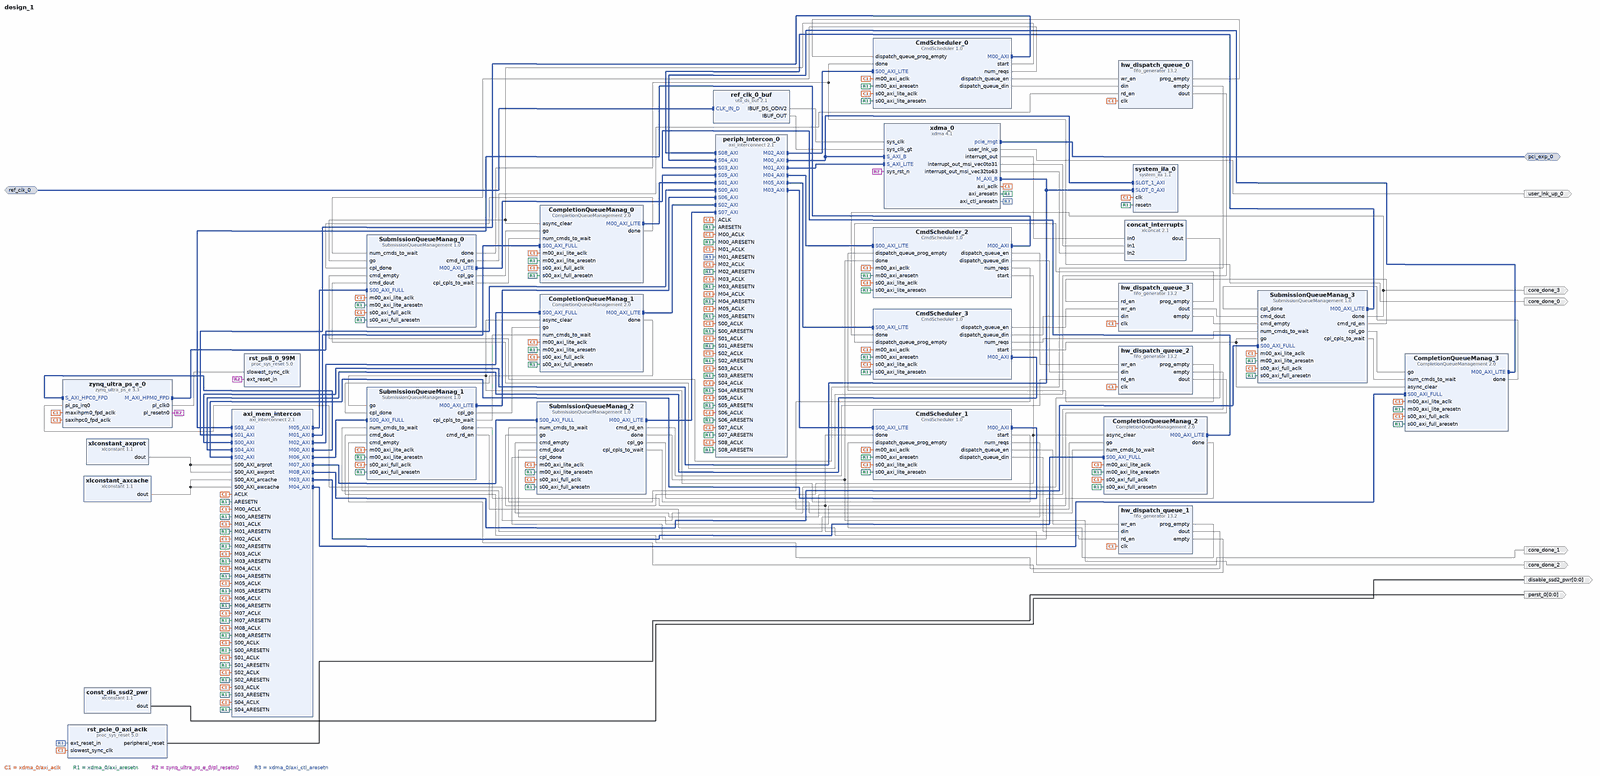
[diagram p0: block diagram of the top level, whole]
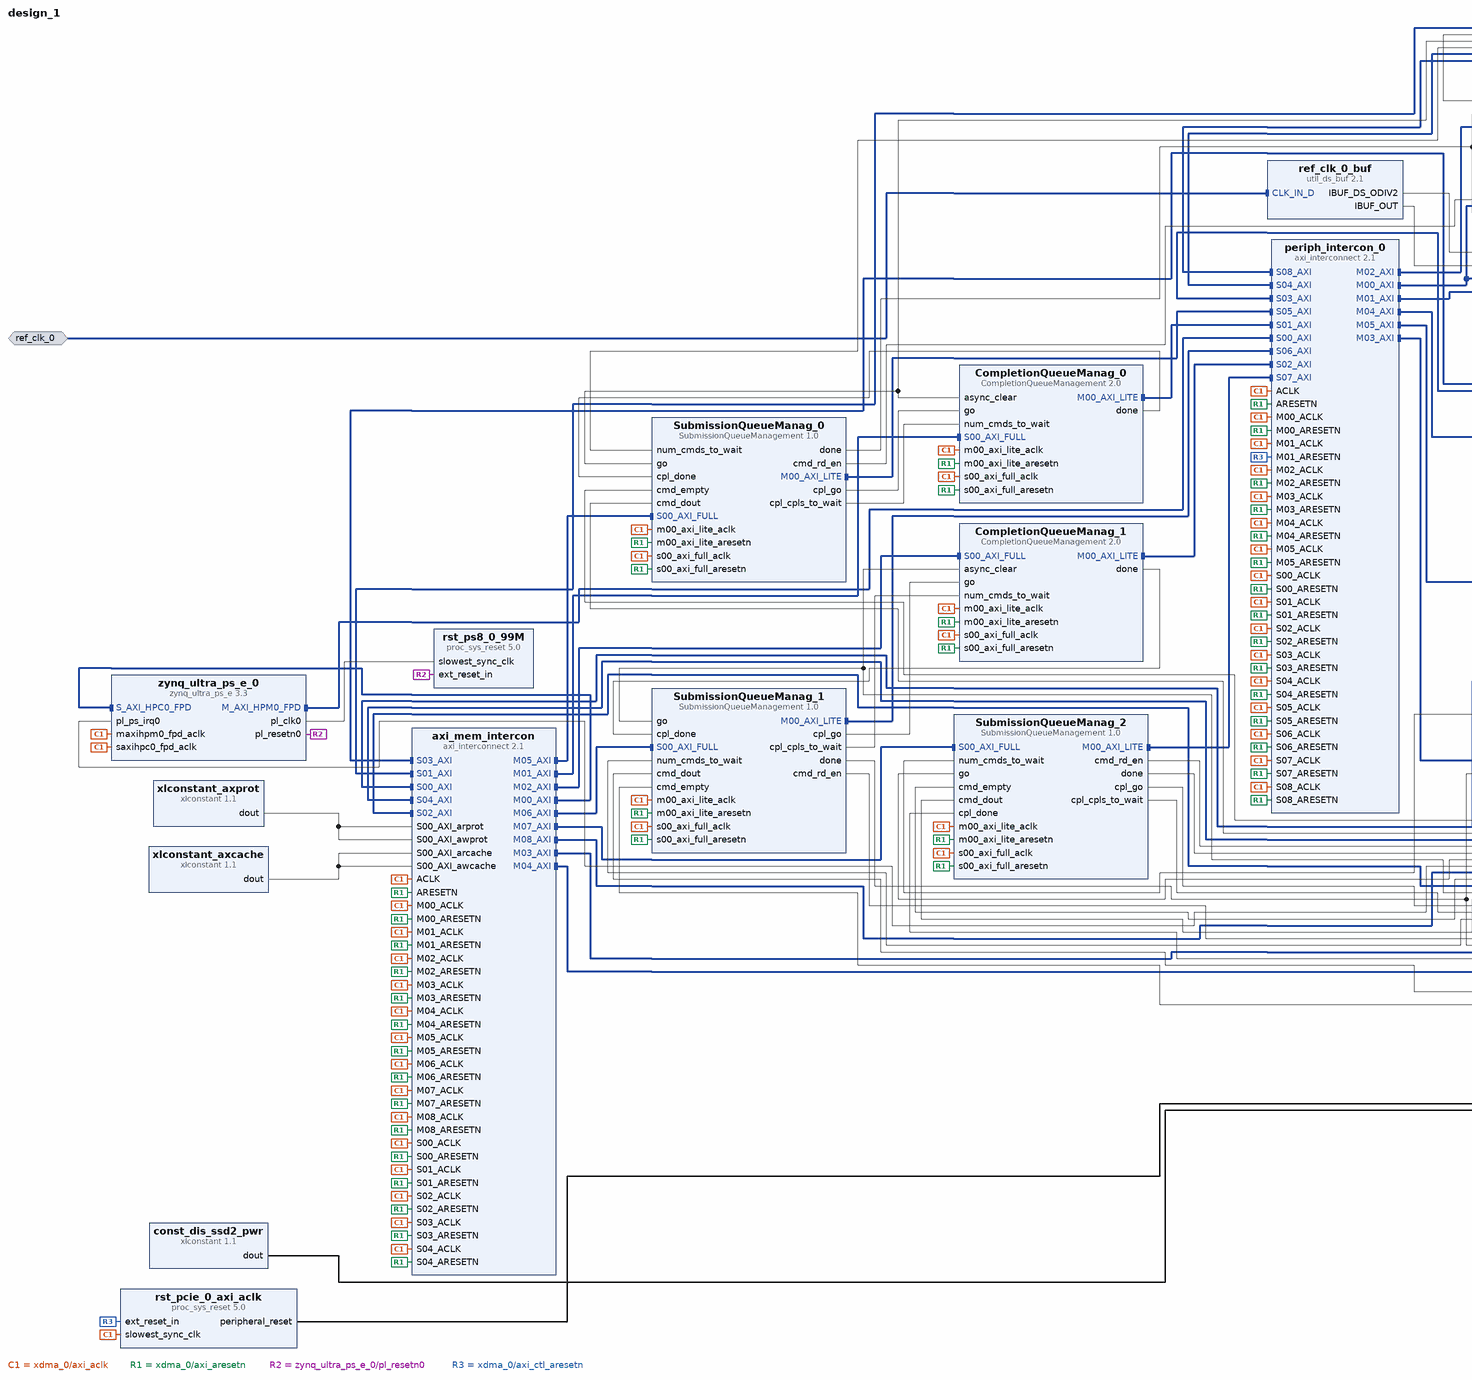
[diagram p1: block diagram of the top level, left part]
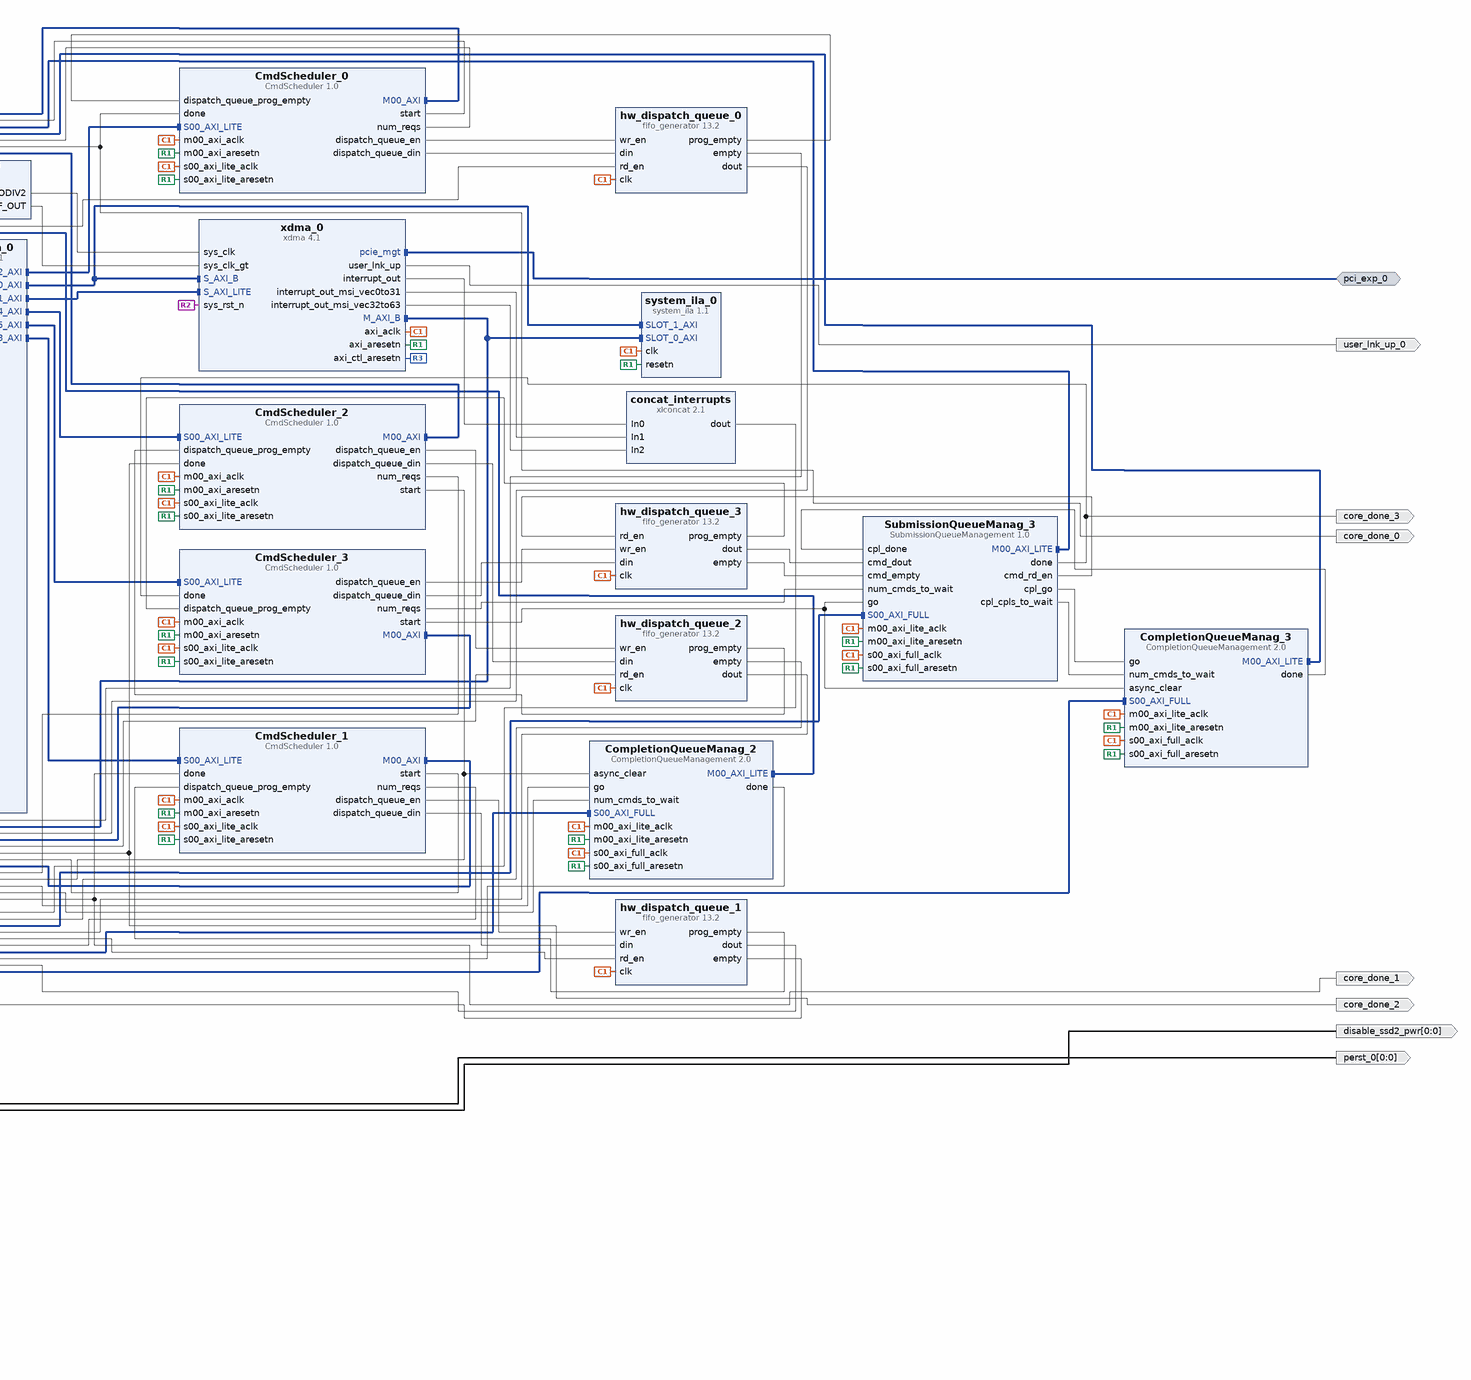
[diagram p2: block diagram of the top level, right part]
# Vivado block design design_1, xczu7ev-ffvc1156-2-e, Vivado 2019.2
create_bd_design design_1

create_bd_intf_port -mode Master -vlnv xilinx.com:interface:pcie_7x_mgt_rtl:1.0 pci_exp_0
create_bd_intf_port -mode Slave -vlnv xilinx.com:interface:diff_clock_rtl:1.0 ref_clk_0
create_bd_port -dir O -from 0 -to 0 -type rst perst_0
create_bd_port -dir O -from 0 -to 0 disable_ssd2_pwr
create_bd_port -dir O user_lnk_up_0
create_bd_port -dir O core_done_0
create_bd_port -dir O core_done_1
create_bd_port -dir O core_done_2
create_bd_port -dir O core_done_3

create_bd_cell -type ip -vlnv xilinx.com:ip:xlconcat:2.1 concat_interrupts
set_property -dict {CONFIG.NUM_PORTS 3} [get_bd_cells concat_interrupts]
create_bd_cell -type ip -vlnv xilinx.com:ip:fifo_generator:13.2 hw_dispatch_queue_0
set_property -dict [list \
  CONFIG.Empty_Threshold_Assert_Value 32 \
  CONFIG.Fifo_Implementation Common_Clock_Distributed_RAM \
  CONFIG.Input_Data_Width 192 \
  CONFIG.Input_Depth 64 \
  CONFIG.Performance_Options First_Word_Fall_Through \
  CONFIG.Programmable_Empty_Type Single_Programmable_Empty_Threshold_Constant \
  CONFIG.Reset_Pin false \
] [get_bd_cells hw_dispatch_queue_0]
create_bd_cell -type ip -vlnv xilinx.com:ip:fifo_generator:13.2 hw_dispatch_queue_1
set_property -dict [list \
  CONFIG.Empty_Threshold_Assert_Value 32 \
  CONFIG.Fifo_Implementation Common_Clock_Distributed_RAM \
  CONFIG.Input_Data_Width 192 \
  CONFIG.Input_Depth 64 \
  CONFIG.Performance_Options First_Word_Fall_Through \
  CONFIG.Programmable_Empty_Type Single_Programmable_Empty_Threshold_Constant \
  CONFIG.Reset_Pin false \
] [get_bd_cells hw_dispatch_queue_1]
create_bd_cell -type ip -vlnv xilinx.com:ip:fifo_generator:13.2 hw_dispatch_queue_2
set_property -dict [list \
  CONFIG.Empty_Threshold_Assert_Value 32 \
  CONFIG.Fifo_Implementation Common_Clock_Distributed_RAM \
  CONFIG.Input_Data_Width 192 \
  CONFIG.Input_Depth 64 \
  CONFIG.Performance_Options First_Word_Fall_Through \
  CONFIG.Programmable_Empty_Type Single_Programmable_Empty_Threshold_Constant \
  CONFIG.Reset_Pin false \
] [get_bd_cells hw_dispatch_queue_2]
create_bd_cell -type ip -vlnv xilinx.com:ip:fifo_generator:13.2 hw_dispatch_queue_3
set_property -dict [list \
  CONFIG.Empty_Threshold_Assert_Value 32 \
  CONFIG.Fifo_Implementation Common_Clock_Distributed_RAM \
  CONFIG.Input_Data_Width 192 \
  CONFIG.Input_Depth 64 \
  CONFIG.Performance_Options First_Word_Fall_Through \
  CONFIG.Programmable_Empty_Type Single_Programmable_Empty_Threshold_Constant \
  CONFIG.Reset_Pin false \
] [get_bd_cells hw_dispatch_queue_3]
create_bd_cell -type ip -vlnv user.org:user:CompletionQueueManagement:2.0 CompletionQueueManag_0
set_property -dict [list \
  CONFIG.CPL_ENTRY_ADDR_WIDTH 5 \
  CONFIG.C_M00_AXI_LITE_TARGET_SLAVE_BASE_ADDR 0x00000000A000100C \
] [get_bd_cells CompletionQueueManag_0]
create_bd_cell -type ip -vlnv user.org:user:CompletionQueueManagement:2.0 CompletionQueueManag_1
set_property -dict [list \
  CONFIG.CPL_ENTRY_ADDR_WIDTH 5 \
  CONFIG.C_M00_AXI_LITE_TARGET_SLAVE_BASE_ADDR 0x00000000A0001014 \
] [get_bd_cells CompletionQueueManag_1]
create_bd_cell -type ip -vlnv user.org:user:CompletionQueueManagement:2.0 CompletionQueueManag_2
set_property -dict [list \
  CONFIG.CPL_ENTRY_ADDR_WIDTH 5 \
  CONFIG.C_M00_AXI_LITE_TARGET_SLAVE_BASE_ADDR 0x00000000A000101C \
] [get_bd_cells CompletionQueueManag_2]
create_bd_cell -type ip -vlnv user.org:user:CompletionQueueManagement:2.0 CompletionQueueManag_3
set_property -dict [list \
  CONFIG.CPL_ENTRY_ADDR_WIDTH 5 \
  CONFIG.C_M00_AXI_LITE_TARGET_SLAVE_BASE_ADDR 0x00000000A0001024 \
] [get_bd_cells CompletionQueueManag_3]
create_bd_cell -type ip -vlnv user.org:user:SubmissionQueueManagement:1.0 SubmissionQueueManag_0
set_property -dict [list \
  CONFIG.C_M00_AXI_LITE_TARGET_SLAVE_BASE_ADDR 0x00000000A0001008 \
  CONFIG.QUEUE_ADDR_WIDTH 5 \
] [get_bd_cells SubmissionQueueManag_0]
create_bd_cell -type ip -vlnv user.org:user:SubmissionQueueManagement:1.0 SubmissionQueueManag_1
set_property -dict [list \
  CONFIG.C_M00_AXI_LITE_TARGET_SLAVE_BASE_ADDR 0x00000000A0001010 \
  CONFIG.QUEUE_ADDR_WIDTH 5 \
] [get_bd_cells SubmissionQueueManag_1]
create_bd_cell -type ip -vlnv user.org:user:SubmissionQueueManagement:1.0 SubmissionQueueManag_2
set_property -dict [list \
  CONFIG.C_M00_AXI_LITE_TARGET_SLAVE_BASE_ADDR 0x00000000A0001018 \
  CONFIG.QUEUE_ADDR_WIDTH 5 \
] [get_bd_cells SubmissionQueueManag_2]
create_bd_cell -type ip -vlnv user.org:user:SubmissionQueueManagement:1.0 SubmissionQueueManag_3
set_property -dict [list \
  CONFIG.C_M00_AXI_LITE_TARGET_SLAVE_BASE_ADDR 0x00000000A0001020 \
  CONFIG.QUEUE_ADDR_WIDTH 5 \
] [get_bd_cells SubmissionQueueManag_3]
create_bd_cell -type ip -vlnv xilinx.com:ip:proc_sys_reset:5.0 rst_pcie_0_axi_aclk
create_bd_cell -type ip -vlnv xilinx.com:ip:proc_sys_reset:5.0 rst_ps8_0_99M
create_bd_cell -type ip -vlnv user.org:user:CmdScheduler:1.0 CmdScheduler_0
set_property -dict {CONFIG.DISPATCH_QUEUE_DEPTH 64} [get_bd_cells CmdScheduler_0]
create_bd_cell -type ip -vlnv user.org:user:CmdScheduler:1.0 CmdScheduler_1
set_property -dict {CONFIG.DISPATCH_QUEUE_DEPTH 64} [get_bd_cells CmdScheduler_1]
create_bd_cell -type ip -vlnv user.org:user:CmdScheduler:1.0 CmdScheduler_2
set_property -dict {CONFIG.DISPATCH_QUEUE_DEPTH 64} [get_bd_cells CmdScheduler_2]
create_bd_cell -type ip -vlnv user.org:user:CmdScheduler:1.0 CmdScheduler_3
set_property -dict {CONFIG.DISPATCH_QUEUE_DEPTH 64} [get_bd_cells CmdScheduler_3]
create_bd_cell -type ip -vlnv xilinx.com:ip:axi_interconnect:2.1 axi_mem_intercon
set_property -dict [list \
  CONFIG.NUM_MI 9 \
  CONFIG.NUM_SI 5 \
  CONFIG.S00_HAS_DATA_FIFO 2 \
  CONFIG.S01_HAS_DATA_FIFO 2 \
  CONFIG.S02_HAS_DATA_FIFO 2 \
  CONFIG.S03_HAS_DATA_FIFO 2 \
  CONFIG.S04_HAS_DATA_FIFO 2 \
  CONFIG.S05_HAS_DATA_FIFO 2 \
  CONFIG.S06_HAS_DATA_FIFO 2 \
  CONFIG.S07_HAS_DATA_FIFO 2 \
  CONFIG.S08_HAS_DATA_FIFO 2 \
  CONFIG.STRATEGY 2 \
] [get_bd_cells axi_mem_intercon]
create_bd_cell -type ip -vlnv xilinx.com:ip:xlconstant:1.1 const_dis_ssd2_pwr
set_property -dict {CONFIG.CONST_VAL 1} [get_bd_cells const_dis_ssd2_pwr]
create_bd_cell -type ip -vlnv xilinx.com:ip:axi_interconnect:2.1 periph_intercon_0
set_property -dict [list \
  CONFIG.NUM_MI 6 \
  CONFIG.NUM_SI 9 \
  CONFIG.S00_HAS_DATA_FIFO 2 \
  CONFIG.S01_HAS_DATA_FIFO 2 \
  CONFIG.S02_HAS_DATA_FIFO 2 \
  CONFIG.S03_HAS_DATA_FIFO 2 \
  CONFIG.S04_HAS_DATA_FIFO 2 \
  CONFIG.S05_HAS_DATA_FIFO 2 \
  CONFIG.S06_HAS_DATA_FIFO 2 \
  CONFIG.S07_HAS_DATA_FIFO 2 \
  CONFIG.S08_HAS_DATA_FIFO 2 \
  CONFIG.S09_HAS_DATA_FIFO 2 \
  CONFIG.S10_HAS_DATA_FIFO 2 \
  CONFIG.S11_HAS_DATA_FIFO 2 \
  CONFIG.S12_HAS_DATA_FIFO 2 \
  CONFIG.S13_HAS_DATA_FIFO 2 \
  CONFIG.S14_HAS_DATA_FIFO 2 \
  CONFIG.S15_HAS_DATA_FIFO 2 \
  CONFIG.STRATEGY 2 \
] [get_bd_cells periph_intercon_0]
create_bd_cell -type ip -vlnv xilinx.com:ip:util_ds_buf:2.1 ref_clk_0_buf
set_property -dict {CONFIG.C_BUF_TYPE IBUFDSGTE} [get_bd_cells ref_clk_0_buf]
create_bd_cell -type ip -vlnv xilinx.com:ip:system_ila:1.1 system_ila_0
set_property -dict [list \
  CONFIG.ALL_PROBE_SAME_MU_CNT 2 \
  CONFIG.C_ADV_TRIGGER true \
  CONFIG.C_EN_STRG_QUAL 1 \
  CONFIG.C_MON_TYPE INTERFACE \
  CONFIG.C_NUM_MONITOR_SLOTS 2 \
  CONFIG.C_PROBE0_MU_CNT 2 \
  CONFIG.C_SLOT_0_APC_EN 0 \
  CONFIG.C_SLOT_0_AXI_AR_SEL_DATA 1 \
  CONFIG.C_SLOT_0_AXI_AR_SEL_TRIG 1 \
  CONFIG.C_SLOT_0_AXI_AW_SEL_DATA 1 \
  CONFIG.C_SLOT_0_AXI_AW_SEL_TRIG 1 \
  CONFIG.C_SLOT_0_AXI_B_SEL_DATA 1 \
  CONFIG.C_SLOT_0_AXI_B_SEL_TRIG 1 \
  CONFIG.C_SLOT_0_AXI_R_SEL_DATA 1 \
  CONFIG.C_SLOT_0_AXI_R_SEL_TRIG 1 \
  CONFIG.C_SLOT_0_AXI_W_SEL_DATA 1 \
  CONFIG.C_SLOT_0_AXI_W_SEL_TRIG 1 \
  CONFIG.C_SLOT_0_INTF_TYPE xilinx.com:interface:aximm_rtl:1.0 \
  CONFIG.C_SLOT_1_APC_EN 0 \
  CONFIG.C_SLOT_1_AXI_AR_SEL_DATA 1 \
  CONFIG.C_SLOT_1_AXI_AR_SEL_TRIG 1 \
  CONFIG.C_SLOT_1_AXI_AW_SEL_DATA 1 \
  CONFIG.C_SLOT_1_AXI_AW_SEL_TRIG 1 \
  CONFIG.C_SLOT_1_AXI_B_SEL_DATA 1 \
  CONFIG.C_SLOT_1_AXI_B_SEL_TRIG 1 \
  CONFIG.C_SLOT_1_AXI_R_SEL_DATA 1 \
  CONFIG.C_SLOT_1_AXI_R_SEL_TRIG 1 \
  CONFIG.C_SLOT_1_AXI_W_SEL_DATA 1 \
  CONFIG.C_SLOT_1_AXI_W_SEL_TRIG 1 \
  CONFIG.C_SLOT_1_INTF_TYPE xilinx.com:interface:aximm_rtl:1.0 \
] [get_bd_cells system_ila_0]
create_bd_cell -type ip -vlnv xilinx.com:ip:xdma:4.1 xdma_0
set_property -dict [list \
  CONFIG.BASEADDR 0x00000000 \
  CONFIG.HIGHADDR 0x001FFFFF \
  CONFIG.INS_LOSS_NYQ 5 \
  CONFIG.PF0_DEVICE_ID_mqdma 9134 \
  CONFIG.PF2_DEVICE_ID_mqdma 9134 \
  CONFIG.PF3_DEVICE_ID_mqdma 9134 \
  CONFIG.axi_addr_width 49 \
  CONFIG.axi_data_width 128_bit \
  CONFIG.axibar2pciebar_0 0x00000000A0000000 \
  CONFIG.axibar_num 1 \
  CONFIG.axisten_freq 250 \
  CONFIG.device_port_type Root_Port_of_PCI_Express_Root_Complex \
  CONFIG.dma_reset_source_sel Phy_Ready \
  CONFIG.en_gt_selection true \
  CONFIG.enable_gen4 true \
  CONFIG.functional_mode AXI_Bridge \
  CONFIG.ins_loss_profile Chip-to-Chip \
  CONFIG.mode_selection Advanced \
  CONFIG.msi_rx_pin_en TRUE \
  CONFIG.pcie_blk_locn X0Y1 \
  CONFIG.pf0_bar0_enabled false \
  CONFIG.pf0_bar0_type_mqdma Memory \
  CONFIG.pf0_base_class_menu Bridge_device \
  CONFIG.pf0_base_class_menu_mqdma Bridge_device \
  CONFIG.pf0_class_code_base_mqdma 06 \
  CONFIG.pf0_class_code_interface 00 \
  CONFIG.pf0_class_code_sub 04 \
  CONFIG.pf0_device_id 9134 \
  CONFIG.pf0_rbar_cap_bar0 0x00000000fff0 \
  CONFIG.pf0_sriov_bar0_type Memory \
  CONFIG.pf0_sub_class_interface_menu PCI_to_PCI_bridge \
  CONFIG.pf1_base_class_menu Bridge_device \
  CONFIG.pf1_base_class_menu_mqdma Bridge_device \
  CONFIG.pf1_class_code_base_mqdma 06 \
  CONFIG.pf1_class_code_interface 00 \
  CONFIG.pf1_class_code_sub 07 \
  CONFIG.pf1_msix_cap_table_size 01F \
  CONFIG.pf1_rbar_cap_bar0 0x00000000fff0 \
  CONFIG.pf1_sub_class_interface_menu CardBus_bridge \
  CONFIG.pf2_base_class_menu_mqdma Bridge_device \
  CONFIG.pf2_class_code_base_mqdma 06 \
  CONFIG.pf2_rbar_cap_bar0 0x00000000fff0 \
  CONFIG.pf3_base_class_menu_mqdma Bridge_device \
  CONFIG.pf3_class_code_base_mqdma 06 \
  CONFIG.pf3_rbar_cap_bar0 0x00000000fff0 \
  CONFIG.pl_link_cap_max_link_speed 8.0_GT/s \
  CONFIG.pl_link_cap_max_link_width X4 \
  CONFIG.plltype QPLL1 \
  CONFIG.select_quad GTH_Quad_226 \
  CONFIG.sys_reset_polarity ACTIVE_LOW \
  CONFIG.type1_membase_memlimit_enable Enabled \
  CONFIG.type1_prefetchable_membase_memlimit 64bit_Enabled \
  CONFIG.xlnx_ref_board ZCU106 \
] [get_bd_cells xdma_0]
create_bd_cell -type ip -vlnv xilinx.com:ip:xlconstant:1.1 xlconstant_axcache
set_property -dict {CONFIG.CONST_VAL 0b1011 CONFIG.CONST_WIDTH 4} [get_bd_cells xlconstant_axcache]
create_bd_cell -type ip -vlnv xilinx.com:ip:xlconstant:1.1 xlconstant_axprot
set_property -dict {CONFIG.CONST_VAL 0b010 CONFIG.CONST_WIDTH 3} [get_bd_cells xlconstant_axprot]
create_bd_cell -type ip -vlnv xilinx.com:ip:zynq_ultra_ps_e:3.3 zynq_ultra_ps_e_0
set_property -dict [list \
  CONFIG.CAN0_BOARD_INTERFACE custom \
  CONFIG.CAN1_BOARD_INTERFACE custom \
  CONFIG.CSU_BOARD_INTERFACE custom \
  CONFIG.DP_BOARD_INTERFACE custom \
  CONFIG.GEM0_BOARD_INTERFACE custom \
  CONFIG.GEM1_BOARD_INTERFACE custom \
  CONFIG.GEM2_BOARD_INTERFACE custom \
  CONFIG.GEM3_BOARD_INTERFACE custom \
  CONFIG.GPIO_BOARD_INTERFACE custom \
  CONFIG.IIC0_BOARD_INTERFACE custom \
  CONFIG.IIC1_BOARD_INTERFACE custom \
  CONFIG.NAND_BOARD_INTERFACE custom \
  CONFIG.PCIE_BOARD_INTERFACE custom \
  CONFIG.PJTAG_BOARD_INTERFACE custom \
  CONFIG.PMU_BOARD_INTERFACE custom \
  CONFIG.PSU_BANK_0_IO_STANDARD LVCMOS18 \
  CONFIG.PSU_BANK_1_IO_STANDARD LVCMOS18 \
  CONFIG.PSU_BANK_2_IO_STANDARD LVCMOS18 \
  CONFIG.PSU_BANK_3_IO_STANDARD LVCMOS33 \
  CONFIG.PSU_DYNAMIC_DDR_CONFIG_EN 1 \
  CONFIG.PSU_USB3__DUAL_CLOCK_ENABLE 1 \
  CONFIG.PSU__CAN1__PERIPHERAL__ENABLE 1 \
  CONFIG.PSU__CAN1__PERIPHERAL__IO {MIO 24 .. 25} \
  CONFIG.PSU__CRF_APB__ACPU_CTRL__FREQMHZ 1200 \
  CONFIG.PSU__CRF_APB__ACPU_CTRL__SRCSEL APLL \
  CONFIG.PSU__CRF_APB__APLL_CTRL__SRCSEL PSS_REF_CLK \
  CONFIG.PSU__CRF_APB__DBG_FPD_CTRL__FREQMHZ 250 \
  CONFIG.PSU__CRF_APB__DBG_FPD_CTRL__SRCSEL IOPLL \
  CONFIG.PSU__CRF_APB__DBG_TRACE_CTRL__FREQMHZ 250 \
  CONFIG.PSU__CRF_APB__DBG_TRACE_CTRL__SRCSEL IOPLL \
  CONFIG.PSU__CRF_APB__DBG_TSTMP_CTRL__FREQMHZ 250 \
  CONFIG.PSU__CRF_APB__DBG_TSTMP_CTRL__SRCSEL IOPLL \
  CONFIG.PSU__CRF_APB__DDR_CTRL__FREQMHZ 1067 \
  CONFIG.PSU__CRF_APB__DDR_CTRL__SRCSEL DPLL \
  CONFIG.PSU__CRF_APB__DPDMA_REF_CTRL__FREQMHZ 600 \
  CONFIG.PSU__CRF_APB__DPDMA_REF_CTRL__SRCSEL APLL \
  CONFIG.PSU__CRF_APB__DPLL_CTRL__SRCSEL PSS_REF_CLK \
  CONFIG.PSU__CRF_APB__DP_AUDIO_REF_CTRL__SRCSEL RPLL \
  CONFIG.PSU__CRF_APB__DP_STC_REF_CTRL__SRCSEL RPLL \
  CONFIG.PSU__CRF_APB__DP_VIDEO_REF_CTRL__SRCSEL VPLL \
  CONFIG.PSU__CRF_APB__GDMA_REF_CTRL__FREQMHZ 600 \
  CONFIG.PSU__CRF_APB__GDMA_REF_CTRL__SRCSEL APLL \
  CONFIG.PSU__CRF_APB__GPU_REF_CTRL__FREQMHZ 500 \
  CONFIG.PSU__CRF_APB__GPU_REF_CTRL__SRCSEL IOPLL \
  CONFIG.PSU__CRF_APB__TOPSW_LSBUS_CTRL__FREQMHZ 100 \
  CONFIG.PSU__CRF_APB__TOPSW_LSBUS_CTRL__SRCSEL IOPLL \
  CONFIG.PSU__CRF_APB__TOPSW_MAIN_CTRL__FREQMHZ 533.33 \
  CONFIG.PSU__CRF_APB__TOPSW_MAIN_CTRL__SRCSEL DPLL \
  CONFIG.PSU__CRF_APB__VPLL_CTRL__SRCSEL PSS_REF_CLK \
  CONFIG.PSU__CRL_APB__ADMA_REF_CTRL__FREQMHZ 500 \
  CONFIG.PSU__CRL_APB__ADMA_REF_CTRL__SRCSEL IOPLL \
  CONFIG.PSU__CRL_APB__CAN1_REF_CTRL__FREQMHZ 100 \
  CONFIG.PSU__CRL_APB__CAN1_REF_CTRL__SRCSEL IOPLL \
  CONFIG.PSU__CRL_APB__CPU_R5_CTRL__FREQMHZ 500 \
  CONFIG.PSU__CRL_APB__CPU_R5_CTRL__SRCSEL IOPLL \
  CONFIG.PSU__CRL_APB__DBG_LPD_CTRL__FREQMHZ 250 \
  CONFIG.PSU__CRL_APB__DBG_LPD_CTRL__SRCSEL IOPLL \
  CONFIG.PSU__CRL_APB__GEM3_REF_CTRL__FREQMHZ 125 \
  CONFIG.PSU__CRL_APB__GEM3_REF_CTRL__SRCSEL IOPLL \
  CONFIG.PSU__CRL_APB__I2C0_REF_CTRL__FREQMHZ 100 \
  CONFIG.PSU__CRL_APB__I2C0_REF_CTRL__SRCSEL IOPLL \
  CONFIG.PSU__CRL_APB__I2C1_REF_CTRL__FREQMHZ 100 \
  CONFIG.PSU__CRL_APB__I2C1_REF_CTRL__SRCSEL IOPLL \
  CONFIG.PSU__CRL_APB__IOPLL_CTRL__SRCSEL PSS_REF_CLK \
  CONFIG.PSU__CRL_APB__IOU_SWITCH_CTRL__FREQMHZ 250 \
  CONFIG.PSU__CRL_APB__IOU_SWITCH_CTRL__SRCSEL IOPLL \
  CONFIG.PSU__CRL_APB__LPD_LSBUS_CTRL__FREQMHZ 100 \
  CONFIG.PSU__CRL_APB__LPD_LSBUS_CTRL__SRCSEL IOPLL \
  CONFIG.PSU__CRL_APB__LPD_SWITCH_CTRL__FREQMHZ 500 \
  CONFIG.PSU__CRL_APB__LPD_SWITCH_CTRL__SRCSEL IOPLL \
  CONFIG.PSU__CRL_APB__PCAP_CTRL__FREQMHZ 200 \
  CONFIG.PSU__CRL_APB__PCAP_CTRL__SRCSEL IOPLL \
  CONFIG.PSU__CRL_APB__PL0_REF_CTRL__FREQMHZ 100 \
  CONFIG.PSU__CRL_APB__PL0_REF_CTRL__SRCSEL IOPLL \
  CONFIG.PSU__CRL_APB__QSPI_REF_CTRL__FREQMHZ 125 \
  CONFIG.PSU__CRL_APB__QSPI_REF_CTRL__SRCSEL IOPLL \
  CONFIG.PSU__CRL_APB__RPLL_CTRL__SRCSEL PSS_REF_CLK \
  CONFIG.PSU__CRL_APB__SDIO1_REF_CTRL__FREQMHZ 200 \
  CONFIG.PSU__CRL_APB__SDIO1_REF_CTRL__SRCSEL IOPLL \
  CONFIG.PSU__CRL_APB__TIMESTAMP_REF_CTRL__FREQMHZ 100 \
  CONFIG.PSU__CRL_APB__TIMESTAMP_REF_CTRL__SRCSEL IOPLL \
  CONFIG.PSU__CRL_APB__UART0_REF_CTRL__FREQMHZ 100 \
  CONFIG.PSU__CRL_APB__UART0_REF_CTRL__SRCSEL IOPLL \
  CONFIG.PSU__CRL_APB__UART1_REF_CTRL__FREQMHZ 100 \
  CONFIG.PSU__CRL_APB__UART1_REF_CTRL__SRCSEL IOPLL \
  CONFIG.PSU__CRL_APB__USB0_BUS_REF_CTRL__FREQMHZ 250 \
  CONFIG.PSU__CRL_APB__USB0_BUS_REF_CTRL__SRCSEL IOPLL \
  CONFIG.PSU__CRL_APB__USB3_DUAL_REF_CTRL__FREQMHZ 20 \
  CONFIG.PSU__CRL_APB__USB3_DUAL_REF_CTRL__SRCSEL IOPLL \
  CONFIG.PSU__CRL_APB__USB3__ENABLE 1 \
  CONFIG.PSU__CSUPMU__PERIPHERAL__VALID 1 \
  CONFIG.PSU__DDRC__BUS_WIDTH {64 Bit} \
  CONFIG.PSU__DDRC__COMPONENTS UDIMM \
  CONFIG.PSU__DDRC__DEVICE_CAPACITY {8192 MBits} \
  CONFIG.PSU__DDRC__DRAM_WIDTH {16 Bits} \
  CONFIG.PSU__DDRC__ECC Disabled \
  CONFIG.PSU__DDRC__MEMORY_TYPE {DDR 4} \
  CONFIG.PSU__DDRC__SPEED_BIN DDR4_2133P \
  CONFIG.PSU__DDR_HIGH_ADDRESS_GUI_ENABLE 1 \
  CONFIG.PSU__DDR__INTERFACE__FREQMHZ 533.500 \
  CONFIG.PSU__DEVICE_TYPE EV \
  CONFIG.PSU__DISPLAYPORT__LANE0__ENABLE 1 \
  CONFIG.PSU__DISPLAYPORT__LANE0__IO {GT Lane1} \
  CONFIG.PSU__DISPLAYPORT__LANE1__ENABLE 1 \
  CONFIG.PSU__DISPLAYPORT__LANE1__IO {GT Lane0} \
  CONFIG.PSU__DISPLAYPORT__PERIPHERAL__ENABLE 1 \
  CONFIG.PSU__DLL__ISUSED 1 \
  CONFIG.PSU__DPAUX__PERIPHERAL__ENABLE 1 \
  CONFIG.PSU__DPAUX__PERIPHERAL__IO {MIO 27 .. 30} \
  CONFIG.PSU__DP__LANE_SEL {Dual Lower} \
  CONFIG.PSU__DP__REF_CLK_FREQ 27 \
  CONFIG.PSU__DP__REF_CLK_SEL {Ref Clk3} \
  CONFIG.PSU__ENET3__FIFO__ENABLE 0 \
  CONFIG.PSU__ENET3__GRP_MDIO__ENABLE 1 \
  CONFIG.PSU__ENET3__GRP_MDIO__IO {MIO 76 .. 77} \
  CONFIG.PSU__ENET3__PERIPHERAL__ENABLE 1 \
  CONFIG.PSU__ENET3__PERIPHERAL__IO {MIO 64 .. 75} \
  CONFIG.PSU__ENET3__PTP__ENABLE 0 \
  CONFIG.PSU__ENET3__TSU__ENABLE 0 \
  CONFIG.PSU__FPGA_PL0_ENABLE 1 \
  CONFIG.PSU__GEM3_COHERENCY 0 \
  CONFIG.PSU__GEM3_ROUTE_THROUGH_FPD 0 \
  CONFIG.PSU__GEM__TSU__ENABLE 0 \
  CONFIG.PSU__GPIO0_MIO__IO {MIO 0 .. 25} \
  CONFIG.PSU__GPIO0_MIO__PERIPHERAL__ENABLE 1 \
  CONFIG.PSU__GPIO1_MIO__IO {MIO 26 .. 51} \
  CONFIG.PSU__GPIO1_MIO__PERIPHERAL__ENABLE 1 \
  CONFIG.PSU__GT__LINK_SPEED HBR \
  CONFIG.PSU__GT__PRE_EMPH_LVL_4 0 \
  CONFIG.PSU__GT__VLT_SWNG_LVL_4 0 \
  CONFIG.PSU__I2C0__PERIPHERAL__ENABLE 1 \
  CONFIG.PSU__I2C0__PERIPHERAL__IO {MIO 14 .. 15} \
  CONFIG.PSU__I2C1__PERIPHERAL__ENABLE 1 \
  CONFIG.PSU__I2C1__PERIPHERAL__IO {MIO 16 .. 17} \
  CONFIG.PSU__IOU_SLCR__IOU_TTC_APB_CLK__TTC0_SEL APB \
  CONFIG.PSU__IOU_SLCR__IOU_TTC_APB_CLK__TTC1_SEL APB \
  CONFIG.PSU__IOU_SLCR__IOU_TTC_APB_CLK__TTC2_SEL APB \
  CONFIG.PSU__IOU_SLCR__IOU_TTC_APB_CLK__TTC3_SEL APB \
  CONFIG.PSU__MAXIGP0__DATA_WIDTH 128 \
  CONFIG.PSU__OVERRIDE_HPX_QOS 0 \
  CONFIG.PSU__OVERRIDE__BASIC_CLOCK 0 \
  CONFIG.PSU__PMU_COHERENCY 0 \
  CONFIG.PSU__PMU__AIBACK__ENABLE 0 \
  CONFIG.PSU__PMU__EMIO_GPI__ENABLE 0 \
  CONFIG.PSU__PMU__EMIO_GPO__ENABLE 0 \
  CONFIG.PSU__PMU__GPI0__ENABLE 0 \
  CONFIG.PSU__PMU__GPI1__ENABLE 0 \
  CONFIG.PSU__PMU__GPI2__ENABLE 0 \
  CONFIG.PSU__PMU__GPI3__ENABLE 0 \
  CONFIG.PSU__PMU__GPI4__ENABLE 0 \
  CONFIG.PSU__PMU__GPI5__ENABLE 0 \
  CONFIG.PSU__PMU__GPO0__ENABLE 1 \
  CONFIG.PSU__PMU__GPO0__IO {MIO 32} \
  CONFIG.PSU__PMU__GPO1__ENABLE 1 \
  CONFIG.PSU__PMU__GPO1__IO {MIO 33} \
  CONFIG.PSU__PMU__GPO2__ENABLE 1 \
  CONFIG.PSU__PMU__GPO2__IO {MIO 34} \
  CONFIG.PSU__PMU__GPO2__POLARITY low \
  CONFIG.PSU__PMU__GPO3__ENABLE 1 \
  CONFIG.PSU__PMU__GPO3__IO {MIO 35} \
  CONFIG.PSU__PMU__GPO3__POLARITY low \
  CONFIG.PSU__PMU__GPO4__ENABLE 1 \
  CONFIG.PSU__PMU__GPO4__IO {MIO 36} \
  CONFIG.PSU__PMU__GPO4__POLARITY low \
  CONFIG.PSU__PMU__GPO5__ENABLE 1 \
  CONFIG.PSU__PMU__GPO5__IO {MIO 37} \
  CONFIG.PSU__PMU__GPO5__POLARITY low \
  CONFIG.PSU__PMU__PERIPHERAL__ENABLE 1 \
  CONFIG.PSU__PMU__PLERROR__ENABLE 0 \
  CONFIG.PSU__PRESET_APPLIED 1 \
  CONFIG.PSU__PSS_REF_CLK__FREQMHZ 33.330 \
  CONFIG.PSU__QSPI_COHERENCY 0 \
  CONFIG.PSU__QSPI_ROUTE_THROUGH_FPD 0 \
  CONFIG.PSU__QSPI__GRP_FBCLK__ENABLE 1 \
  CONFIG.PSU__QSPI__GRP_FBCLK__IO {MIO 6} \
  CONFIG.PSU__QSPI__PERIPHERAL__DATA_MODE x4 \
  CONFIG.PSU__QSPI__PERIPHERAL__ENABLE 1 \
  CONFIG.PSU__QSPI__PERIPHERAL__IO {MIO 0 .. 12} \
  CONFIG.PSU__QSPI__PERIPHERAL__MODE {Dual Parallel} \
  CONFIG.PSU__SATA__LANE1__IO {GT Lane3} \
  CONFIG.PSU__SATA__PERIPHERAL__ENABLE 1 \
  CONFIG.PSU__SATA__REF_CLK_FREQ 125 \
  CONFIG.PSU__SATA__REF_CLK_SEL {Ref Clk1} \
  CONFIG.PSU__SD1_COHERENCY 0 \
  CONFIG.PSU__SD1_ROUTE_THROUGH_FPD 0 \
  CONFIG.PSU__SD1__DATA_TRANSFER_MODE 8Bit \
  CONFIG.PSU__SD1__GRP_CD__ENABLE 1 \
  CONFIG.PSU__SD1__GRP_CD__IO {MIO 45} \
  CONFIG.PSU__SD1__GRP_POW__ENABLE 1 \
  CONFIG.PSU__SD1__GRP_POW__IO {MIO 43} \
  CONFIG.PSU__SD1__GRP_WP__ENABLE 1 \
  CONFIG.PSU__SD1__GRP_WP__IO {MIO 44} \
  CONFIG.PSU__SD1__PERIPHERAL__ENABLE 1 \
  CONFIG.PSU__SD1__PERIPHERAL__IO {MIO 39 .. 51} \
  CONFIG.PSU__SD1__SLOT_TYPE {SD 3.0} \
  CONFIG.PSU__SWDT0__CLOCK__ENABLE 0 \
  CONFIG.PSU__SWDT0__PERIPHERAL__ENABLE 1 \
  CONFIG.PSU__SWDT0__RESET__ENABLE 0 \
  CONFIG.PSU__SWDT1__CLOCK__ENABLE 0 \
  CONFIG.PSU__SWDT1__PERIPHERAL__ENABLE 1 \
  CONFIG.PSU__SWDT1__RESET__ENABLE 0 \
  CONFIG.PSU__TSU__BUFG_PORT_PAIR 0 \
  CONFIG.PSU__TTC0__CLOCK__ENABLE 0 \
  CONFIG.PSU__TTC0__PERIPHERAL__ENABLE 1 \
  CONFIG.PSU__TTC0__WAVEOUT__ENABLE 0 \
  CONFIG.PSU__TTC1__CLOCK__ENABLE 0 \
  CONFIG.PSU__TTC1__PERIPHERAL__ENABLE 1 \
  CONFIG.PSU__TTC1__WAVEOUT__ENABLE 0 \
  CONFIG.PSU__TTC2__CLOCK__ENABLE 0 \
  CONFIG.PSU__TTC2__PERIPHERAL__ENABLE 1 \
  CONFIG.PSU__TTC2__WAVEOUT__ENABLE 0 \
  CONFIG.PSU__TTC3__CLOCK__ENABLE 0 \
  CONFIG.PSU__TTC3__PERIPHERAL__ENABLE 1 \
  CONFIG.PSU__TTC3__WAVEOUT__ENABLE 0 \
  CONFIG.PSU__UART0__BAUD_RATE 115200 \
  CONFIG.PSU__UART0__MODEM__ENABLE 0 \
  CONFIG.PSU__UART0__PERIPHERAL__ENABLE 1 \
  CONFIG.PSU__UART0__PERIPHERAL__IO {MIO 18 .. 19} \
  CONFIG.PSU__UART1__BAUD_RATE 115200 \
  CONFIG.PSU__UART1__MODEM__ENABLE 0 \
  CONFIG.PSU__UART1__PERIPHERAL__ENABLE 1 \
  CONFIG.PSU__UART1__PERIPHERAL__IO {MIO 20 .. 21} \
  CONFIG.PSU__USB0_COHERENCY 0 \
  CONFIG.PSU__USB0__PERIPHERAL__ENABLE 1 \
  CONFIG.PSU__USB0__PERIPHERAL__IO {MIO 52 .. 63} \
  CONFIG.PSU__USB0__REF_CLK_FREQ 26 \
  CONFIG.PSU__USB0__REF_CLK_SEL {Ref Clk2} \
  CONFIG.PSU__USB2_0__EMIO__ENABLE 0 \
  CONFIG.PSU__USB3_0__EMIO__ENABLE 0 \
  CONFIG.PSU__USB3_0__PERIPHERAL__ENABLE 1 \
  CONFIG.PSU__USB3_0__PERIPHERAL__IO {GT Lane2} \
  CONFIG.PSU__USB__RESET__MODE {Boot Pin} \
  CONFIG.PSU__USB__RESET__POLARITY {Active Low} \
  CONFIG.PSU__USE__IRQ0 1 \
  CONFIG.PSU__USE__M_AXI_GP0 1 \
  CONFIG.PSU__USE__M_AXI_GP1 0 \
  CONFIG.PSU__USE__M_AXI_GP2 0 \
  CONFIG.PSU__USE__S_AXI_GP0 1 \
  CONFIG.QSPI_BOARD_INTERFACE custom \
  CONFIG.SATA_BOARD_INTERFACE custom \
  CONFIG.SD0_BOARD_INTERFACE custom \
  CONFIG.SD1_BOARD_INTERFACE custom \
  CONFIG.SPI0_BOARD_INTERFACE custom \
  CONFIG.SPI1_BOARD_INTERFACE custom \
  CONFIG.SUBPRESET1 Custom \
  CONFIG.SUBPRESET2 Custom \
  CONFIG.SWDT0_BOARD_INTERFACE custom \
  CONFIG.SWDT1_BOARD_INTERFACE custom \
  CONFIG.TRACE_BOARD_INTERFACE custom \
  CONFIG.TTC0_BOARD_INTERFACE custom \
  CONFIG.TTC1_BOARD_INTERFACE custom \
  CONFIG.TTC2_BOARD_INTERFACE custom \
  CONFIG.TTC3_BOARD_INTERFACE custom \
  CONFIG.UART0_BOARD_INTERFACE custom \
  CONFIG.UART1_BOARD_INTERFACE custom \
  CONFIG.USB0_BOARD_INTERFACE custom \
  CONFIG.USB1_BOARD_INTERFACE custom \
] [get_bd_cells zynq_ultra_ps_e_0]
# 725 more settings of zynq_ultra_ps_e_0 are not shown: defaults, MIO pin electricals, DDR timing, and values the tool derives

# ---- connections ----

connect_bd_intf_net [get_bd_intf_pins axi_mem_intercon/M01_AXI] [get_bd_intf_pins CompletionQueueManag_0/S00_AXI_FULL]
connect_bd_intf_net [get_bd_intf_pins CmdScheduler_2/M00_AXI] [get_bd_intf_pins axi_mem_intercon/S03_AXI]
connect_bd_intf_net [get_bd_intf_pins axi_mem_intercon/M02_AXI] [get_bd_intf_pins CompletionQueueManag_1/S00_AXI_FULL]
connect_bd_intf_net [get_bd_intf_pins CompletionQueueManag_2/M00_AXI_LITE] [get_bd_intf_pins periph_intercon_0/S03_AXI]
connect_bd_intf_net -intf_net ref_clk_0_1 [get_bd_intf_ports ref_clk_0] [get_bd_intf_pins ref_clk_0_buf/CLK_IN_D]
connect_bd_intf_net [get_bd_intf_pins CmdScheduler_0/M00_AXI] [get_bd_intf_pins axi_mem_intercon/S01_AXI]
connect_bd_intf_net [get_bd_intf_pins axi_mem_intercon/M08_AXI] [get_bd_intf_pins SubmissionQueueManag_3/S00_AXI_FULL]
connect_bd_intf_net [get_bd_intf_pins SubmissionQueueManag_2/M00_AXI_LITE] [get_bd_intf_pins periph_intercon_0/S07_AXI]
connect_bd_intf_net [get_bd_intf_pins axi_mem_intercon/M06_AXI] [get_bd_intf_pins SubmissionQueueManag_1/S00_AXI_FULL]
connect_bd_intf_net [get_bd_intf_pins axi_mem_intercon/M03_AXI] [get_bd_intf_pins CompletionQueueManag_2/S00_AXI_FULL]
connect_bd_intf_net [get_bd_intf_pins CompletionQueueManag_0/M00_AXI_LITE] [get_bd_intf_pins periph_intercon_0/S01_AXI]
connect_bd_intf_net -intf_net periph_intercon_0_M00_AXI [get_bd_intf_pins periph_intercon_0/M00_AXI] [get_bd_intf_pins xdma_0/S_AXI_B]
connect_bd_intf_net [get_bd_intf_pins periph_intercon_0/M00_AXI] [get_bd_intf_pins system_ila_0/SLOT_1_AXI]
connect_bd_intf_net [get_bd_intf_pins SubmissionQueueManag_1/M00_AXI_LITE] [get_bd_intf_pins periph_intercon_0/S06_AXI]
connect_bd_intf_net -intf_net xdma_0_M_AXI_B [get_bd_intf_pins xdma_0/M_AXI_B] [get_bd_intf_pins axi_mem_intercon/S00_AXI]
connect_bd_intf_net [get_bd_intf_pins xdma_0/M_AXI_B] [get_bd_intf_pins system_ila_0/SLOT_0_AXI]
connect_bd_intf_net [get_bd_intf_pins axi_mem_intercon/M04_AXI] [get_bd_intf_pins CompletionQueueManag_3/S00_AXI_FULL]
connect_bd_intf_net [get_bd_intf_pins periph_intercon_0/M01_AXI] [get_bd_intf_pins xdma_0/S_AXI_LITE]
connect_bd_intf_net [get_bd_intf_pins axi_mem_intercon/M05_AXI] [get_bd_intf_pins SubmissionQueueManag_0/S00_AXI_FULL]
connect_bd_intf_net [get_bd_intf_pins SubmissionQueueManag_0/M00_AXI_LITE] [get_bd_intf_pins periph_intercon_0/S05_AXI]
connect_bd_intf_net [get_bd_intf_pins axi_mem_intercon/M00_AXI] [get_bd_intf_pins zynq_ultra_ps_e_0/S_AXI_HPC0_FPD]
connect_bd_intf_net [get_bd_intf_pins SubmissionQueueManag_3/M00_AXI_LITE] [get_bd_intf_pins periph_intercon_0/S08_AXI]
connect_bd_intf_net [get_bd_intf_pins CmdScheduler_3/M00_AXI] [get_bd_intf_pins axi_mem_intercon/S04_AXI]
connect_bd_intf_net [get_bd_intf_ports pci_exp_0] [get_bd_intf_pins xdma_0/pcie_mgt]
connect_bd_intf_net [get_bd_intf_pins periph_intercon_0/M03_AXI] [get_bd_intf_pins CmdScheduler_1/S00_AXI_LITE]
connect_bd_intf_net [get_bd_intf_pins periph_intercon_0/M05_AXI] [get_bd_intf_pins CmdScheduler_3/S00_AXI_LITE]
connect_bd_intf_net [get_bd_intf_pins axi_mem_intercon/M07_AXI] [get_bd_intf_pins SubmissionQueueManag_2/S00_AXI_FULL]
connect_bd_intf_net [get_bd_intf_pins CompletionQueueManag_1/M00_AXI_LITE] [get_bd_intf_pins periph_intercon_0/S02_AXI]
connect_bd_intf_net [get_bd_intf_pins CmdScheduler_1/M00_AXI] [get_bd_intf_pins axi_mem_intercon/S02_AXI]
connect_bd_intf_net -intf_net zynq_ultra_ps_e_0_M_AXI_HPM0_FPD [get_bd_intf_pins zynq_ultra_ps_e_0/M_AXI_HPM0_FPD] [get_bd_intf_pins periph_intercon_0/S00_AXI]
connect_bd_intf_net [get_bd_intf_pins periph_intercon_0/M04_AXI] [get_bd_intf_pins CmdScheduler_2/S00_AXI_LITE]
connect_bd_intf_net [get_bd_intf_pins periph_intercon_0/M02_AXI] [get_bd_intf_pins CmdScheduler_0/S00_AXI_LITE]
connect_bd_intf_net [get_bd_intf_pins CompletionQueueManag_3/M00_AXI_LITE] [get_bd_intf_pins periph_intercon_0/S04_AXI]
connect_bd_net [get_bd_pins zynq_ultra_ps_e_0/pl_clk0] [get_bd_pins rst_ps8_0_99M/slowest_sync_clk]
connect_bd_net [get_bd_pins xdma_0/axi_aclk] \
  [get_bd_pins hw_dispatch_queue_0/clk] [get_bd_pins hw_dispatch_queue_1/clk] [get_bd_pins hw_dispatch_queue_2/clk] \
  [get_bd_pins hw_dispatch_queue_3/clk] [get_bd_pins CompletionQueueManag_0/m00_axi_lite_aclk] \
  [get_bd_pins CompletionQueueManag_0/s00_axi_full_aclk] [get_bd_pins CompletionQueueManag_1/m00_axi_lite_aclk] \
  [get_bd_pins CompletionQueueManag_1/s00_axi_full_aclk] [get_bd_pins CompletionQueueManag_2/m00_axi_lite_aclk] \
  [get_bd_pins CompletionQueueManag_2/s00_axi_full_aclk] [get_bd_pins CompletionQueueManag_3/m00_axi_lite_aclk] \
  [get_bd_pins CompletionQueueManag_3/s00_axi_full_aclk] [get_bd_pins SubmissionQueueManag_0/m00_axi_lite_aclk] \
  [get_bd_pins SubmissionQueueManag_0/s00_axi_full_aclk] [get_bd_pins SubmissionQueueManag_1/m00_axi_lite_aclk] \
  [get_bd_pins SubmissionQueueManag_1/s00_axi_full_aclk] [get_bd_pins SubmissionQueueManag_2/m00_axi_lite_aclk] \
  [get_bd_pins SubmissionQueueManag_2/s00_axi_full_aclk] [get_bd_pins SubmissionQueueManag_3/m00_axi_lite_aclk] \
  [get_bd_pins SubmissionQueueManag_3/s00_axi_full_aclk] [get_bd_pins rst_pcie_0_axi_aclk/slowest_sync_clk] \
  [get_bd_pins CmdScheduler_0/s00_axi_lite_aclk] [get_bd_pins CmdScheduler_0/m00_axi_aclk] \
  [get_bd_pins CmdScheduler_1/s00_axi_lite_aclk] [get_bd_pins CmdScheduler_1/m00_axi_aclk] \
  [get_bd_pins CmdScheduler_2/s00_axi_lite_aclk] [get_bd_pins CmdScheduler_2/m00_axi_aclk] \
  [get_bd_pins CmdScheduler_3/s00_axi_lite_aclk] [get_bd_pins CmdScheduler_3/m00_axi_aclk] \
  [get_bd_pins axi_mem_intercon/ACLK] [get_bd_pins axi_mem_intercon/S00_ACLK] [get_bd_pins axi_mem_intercon/M00_ACLK] \
  [get_bd_pins axi_mem_intercon/M01_ACLK] [get_bd_pins axi_mem_intercon/S01_ACLK] [get_bd_pins axi_mem_intercon/S02_ACLK] \
  [get_bd_pins axi_mem_intercon/S03_ACLK] [get_bd_pins axi_mem_intercon/S04_ACLK] [get_bd_pins axi_mem_intercon/M02_ACLK] \
  [get_bd_pins axi_mem_intercon/M03_ACLK] [get_bd_pins axi_mem_intercon/M04_ACLK] [get_bd_pins axi_mem_intercon/M05_ACLK] \
  [get_bd_pins axi_mem_intercon/M06_ACLK] [get_bd_pins axi_mem_intercon/M07_ACLK] [get_bd_pins axi_mem_intercon/M08_ACLK] \
  [get_bd_pins periph_intercon_0/ACLK] [get_bd_pins periph_intercon_0/S00_ACLK] [get_bd_pins periph_intercon_0/M00_ACLK] \
  [get_bd_pins periph_intercon_0/M01_ACLK] [get_bd_pins periph_intercon_0/S01_ACLK] [get_bd_pins periph_intercon_0/S02_ACLK] \
  [get_bd_pins periph_intercon_0/S03_ACLK] [get_bd_pins periph_intercon_0/S04_ACLK] [get_bd_pins periph_intercon_0/S05_ACLK] \
  [get_bd_pins periph_intercon_0/S06_ACLK] [get_bd_pins periph_intercon_0/S07_ACLK] [get_bd_pins periph_intercon_0/S08_ACLK] \
  [get_bd_pins periph_intercon_0/M02_ACLK] [get_bd_pins periph_intercon_0/M03_ACLK] [get_bd_pins periph_intercon_0/M04_ACLK] \
  [get_bd_pins periph_intercon_0/M05_ACLK] [get_bd_pins system_ila_0/clk] [get_bd_pins zynq_ultra_ps_e_0/maxihpm0_fpd_aclk] \
  [get_bd_pins zynq_ultra_ps_e_0/saxihpc0_fpd_aclk]
connect_bd_net [get_bd_pins xdma_0/axi_aresetn] \
  [get_bd_pins CompletionQueueManag_0/m00_axi_lite_aresetn] [get_bd_pins CompletionQueueManag_0/s00_axi_full_aresetn] \
  [get_bd_pins CompletionQueueManag_1/m00_axi_lite_aresetn] [get_bd_pins CompletionQueueManag_1/s00_axi_full_aresetn] \
  [get_bd_pins CompletionQueueManag_2/m00_axi_lite_aresetn] [get_bd_pins CompletionQueueManag_2/s00_axi_full_aresetn] \
  [get_bd_pins CompletionQueueManag_3/m00_axi_lite_aresetn] [get_bd_pins CompletionQueueManag_3/s00_axi_full_aresetn] \
  [get_bd_pins SubmissionQueueManag_0/m00_axi_lite_aresetn] [get_bd_pins SubmissionQueueManag_0/s00_axi_full_aresetn] \
  [get_bd_pins SubmissionQueueManag_1/m00_axi_lite_aresetn] [get_bd_pins SubmissionQueueManag_1/s00_axi_full_aresetn] \
  [get_bd_pins SubmissionQueueManag_2/m00_axi_lite_aresetn] [get_bd_pins SubmissionQueueManag_2/s00_axi_full_aresetn] \
  [get_bd_pins SubmissionQueueManag_3/m00_axi_lite_aresetn] [get_bd_pins SubmissionQueueManag_3/s00_axi_full_aresetn] \
  [get_bd_pins CmdScheduler_0/s00_axi_lite_aresetn] [get_bd_pins CmdScheduler_0/m00_axi_aresetn] \
  [get_bd_pins CmdScheduler_1/s00_axi_lite_aresetn] [get_bd_pins CmdScheduler_1/m00_axi_aresetn] \
  [get_bd_pins CmdScheduler_2/s00_axi_lite_aresetn] [get_bd_pins CmdScheduler_2/m00_axi_aresetn] \
  [get_bd_pins CmdScheduler_3/s00_axi_lite_aresetn] [get_bd_pins CmdScheduler_3/m00_axi_aresetn] \
  [get_bd_pins axi_mem_intercon/ARESETN] [get_bd_pins axi_mem_intercon/S00_ARESETN] \
  [get_bd_pins axi_mem_intercon/M00_ARESETN] [get_bd_pins axi_mem_intercon/M01_ARESETN] \
  [get_bd_pins axi_mem_intercon/S01_ARESETN] [get_bd_pins axi_mem_intercon/S02_ARESETN] \
  [get_bd_pins axi_mem_intercon/S03_ARESETN] [get_bd_pins axi_mem_intercon/S04_ARESETN] \
  [get_bd_pins axi_mem_intercon/M02_ARESETN] [get_bd_pins axi_mem_intercon/M03_ARESETN] \
  [get_bd_pins axi_mem_intercon/M04_ARESETN] [get_bd_pins axi_mem_intercon/M05_ARESETN] \
  [get_bd_pins axi_mem_intercon/M06_ARESETN] [get_bd_pins axi_mem_intercon/M07_ARESETN] \
  [get_bd_pins axi_mem_intercon/M08_ARESETN] [get_bd_pins periph_intercon_0/ARESETN] \
  [get_bd_pins periph_intercon_0/S00_ARESETN] [get_bd_pins periph_intercon_0/M00_ARESETN] \
  [get_bd_pins periph_intercon_0/S01_ARESETN] [get_bd_pins periph_intercon_0/S02_ARESETN] \
  [get_bd_pins periph_intercon_0/S03_ARESETN] [get_bd_pins periph_intercon_0/S04_ARESETN] \
  [get_bd_pins periph_intercon_0/S05_ARESETN] [get_bd_pins periph_intercon_0/S06_ARESETN] \
  [get_bd_pins periph_intercon_0/S07_ARESETN] [get_bd_pins periph_intercon_0/S08_ARESETN] \
  [get_bd_pins periph_intercon_0/M02_ARESETN] [get_bd_pins periph_intercon_0/M03_ARESETN] \
  [get_bd_pins periph_intercon_0/M04_ARESETN] [get_bd_pins periph_intercon_0/M05_ARESETN] [get_bd_pins system_ila_0/resetn]
connect_bd_net [get_bd_pins zynq_ultra_ps_e_0/pl_resetn0] [get_bd_pins rst_ps8_0_99M/ext_reset_in] [get_bd_pins xdma_0/sys_rst_n]
connect_bd_net [get_bd_pins ref_clk_0_buf/IBUF_DS_ODIV2] [get_bd_pins xdma_0/sys_clk]
connect_bd_net [get_bd_pins ref_clk_0_buf/IBUF_OUT] [get_bd_pins xdma_0/sys_clk_gt]
connect_bd_net [get_bd_pins concat_interrupts/dout] [get_bd_pins zynq_ultra_ps_e_0/pl_ps_irq0]
connect_bd_net [get_bd_pins xdma_0/interrupt_out] [get_bd_pins concat_interrupts/In0]
connect_bd_net [get_bd_pins xdma_0/interrupt_out_msi_vec0to31] [get_bd_pins concat_interrupts/In1]
connect_bd_net [get_bd_pins xdma_0/interrupt_out_msi_vec32to63] [get_bd_pins concat_interrupts/In2]
connect_bd_net [get_bd_pins xdma_0/axi_ctl_aresetn] [get_bd_pins rst_pcie_0_axi_aclk/ext_reset_in] [get_bd_pins periph_intercon_0/M01_ARESETN]
connect_bd_net [get_bd_pins rst_pcie_0_axi_aclk/peripheral_reset] [get_bd_ports perst_0]
connect_bd_net [get_bd_pins const_dis_ssd2_pwr/dout] [get_bd_ports disable_ssd2_pwr]
connect_bd_net [get_bd_pins xdma_0/user_lnk_up] [get_bd_ports user_lnk_up_0]
connect_bd_net [get_bd_pins hw_dispatch_queue_0/prog_empty] [get_bd_pins CmdScheduler_0/dispatch_queue_prog_empty]
connect_bd_net [get_bd_pins CmdScheduler_0/dispatch_queue_en] [get_bd_pins hw_dispatch_queue_0/wr_en]
connect_bd_net [get_bd_pins CmdScheduler_0/dispatch_queue_din] [get_bd_pins hw_dispatch_queue_0/din]
connect_bd_net [get_bd_pins CompletionQueueManag_0/done] [get_bd_pins SubmissionQueueManag_0/cpl_done]
connect_bd_net [get_bd_pins SubmissionQueueManag_0/cpl_go] [get_bd_pins CompletionQueueManag_0/go]
connect_bd_net [get_bd_pins hw_dispatch_queue_0/empty] [get_bd_pins SubmissionQueueManag_0/cmd_empty]
connect_bd_net [get_bd_pins hw_dispatch_queue_0/dout] [get_bd_pins SubmissionQueueManag_0/cmd_dout]
connect_bd_net [get_bd_pins SubmissionQueueManag_0/cmd_rd_en] [get_bd_pins hw_dispatch_queue_0/rd_en]
connect_bd_net [get_bd_pins SubmissionQueueManag_0/cpl_cpls_to_wait] [get_bd_pins CompletionQueueManag_0/num_cmds_to_wait]
connect_bd_net [get_bd_pins CmdScheduler_0/start] [get_bd_pins CompletionQueueManag_0/async_clear] [get_bd_pins SubmissionQueueManag_0/go]
connect_bd_net [get_bd_pins CmdScheduler_0/num_reqs] [get_bd_pins SubmissionQueueManag_0/num_cmds_to_wait]
connect_bd_net -net SubmissionQueueManag_0_done [get_bd_pins SubmissionQueueManag_0/done] [get_bd_ports core_done_0] [get_bd_pins CmdScheduler_0/done]
connect_bd_net [get_bd_pins CompletionQueueManag_1/done] [get_bd_pins SubmissionQueueManag_1/cpl_done]
connect_bd_net [get_bd_pins SubmissionQueueManag_1/cpl_go] [get_bd_pins CompletionQueueManag_1/go]
connect_bd_net [get_bd_pins SubmissionQueueManag_1/cpl_cpls_to_wait] [get_bd_pins CompletionQueueManag_1/num_cmds_to_wait]
connect_bd_net -net SubmissionQueueManag_1_done [get_bd_pins SubmissionQueueManag_1/done] [get_bd_ports core_done_1] [get_bd_pins CmdScheduler_1/done]
connect_bd_net [get_bd_pins SubmissionQueueManag_1/cmd_rd_en] [get_bd_pins hw_dispatch_queue_1/rd_en]
connect_bd_net [get_bd_pins CmdScheduler_1/start] [get_bd_pins CompletionQueueManag_1/async_clear] [get_bd_pins SubmissionQueueManag_1/go]
connect_bd_net [get_bd_pins CmdScheduler_1/num_reqs] [get_bd_pins SubmissionQueueManag_1/num_cmds_to_wait]
connect_bd_net [get_bd_pins hw_dispatch_queue_1/prog_empty] [get_bd_pins CmdScheduler_1/dispatch_queue_prog_empty]
connect_bd_net [get_bd_pins CmdScheduler_1/dispatch_queue_en] [get_bd_pins hw_dispatch_queue_1/wr_en]
connect_bd_net [get_bd_pins CmdScheduler_1/dispatch_queue_din] [get_bd_pins hw_dispatch_queue_1/din]
connect_bd_net [get_bd_pins hw_dispatch_queue_1/dout] [get_bd_pins SubmissionQueueManag_1/cmd_dout]
connect_bd_net [get_bd_pins hw_dispatch_queue_1/empty] [get_bd_pins SubmissionQueueManag_1/cmd_empty]
connect_bd_net [get_bd_pins CmdScheduler_2/start] [get_bd_pins CompletionQueueManag_2/async_clear] [get_bd_pins SubmissionQueueManag_2/go]
connect_bd_net [get_bd_pins CmdScheduler_2/num_reqs] [get_bd_pins SubmissionQueueManag_2/num_cmds_to_wait]
connect_bd_net [get_bd_pins CmdScheduler_2/dispatch_queue_en] [get_bd_pins hw_dispatch_queue_2/wr_en]
connect_bd_net [get_bd_pins CmdScheduler_2/dispatch_queue_din] [get_bd_pins hw_dispatch_queue_2/din]
connect_bd_net [get_bd_pins SubmissionQueueManag_2/done] [get_bd_ports core_done_2] [get_bd_pins CmdScheduler_2/done]
connect_bd_net [get_bd_pins hw_dispatch_queue_2/prog_empty] [get_bd_pins CmdScheduler_2/dispatch_queue_prog_empty]
connect_bd_net [get_bd_pins SubmissionQueueManag_2/cpl_go] [get_bd_pins CompletionQueueManag_2/go]
connect_bd_net [get_bd_pins SubmissionQueueManag_2/cmd_rd_en] [get_bd_pins hw_dispatch_queue_2/rd_en]
connect_bd_net [get_bd_pins SubmissionQueueManag_2/cpl_cpls_to_wait] [get_bd_pins CompletionQueueManag_2/num_cmds_to_wait]
connect_bd_net [get_bd_pins CompletionQueueManag_2/done] [get_bd_pins SubmissionQueueManag_2/cpl_done]
connect_bd_net [get_bd_pins hw_dispatch_queue_2/empty] [get_bd_pins SubmissionQueueManag_2/cmd_empty]
connect_bd_net [get_bd_pins hw_dispatch_queue_2/dout] [get_bd_pins SubmissionQueueManag_2/cmd_dout]
connect_bd_net [get_bd_pins CmdScheduler_3/start] [get_bd_pins CompletionQueueManag_3/async_clear] [get_bd_pins SubmissionQueueManag_3/go]
connect_bd_net [get_bd_pins CmdScheduler_3/num_reqs] [get_bd_pins SubmissionQueueManag_3/num_cmds_to_wait]
connect_bd_net [get_bd_pins CmdScheduler_3/dispatch_queue_en] [get_bd_pins hw_dispatch_queue_3/wr_en]
connect_bd_net [get_bd_pins CmdScheduler_3/dispatch_queue_din] [get_bd_pins hw_dispatch_queue_3/din]
connect_bd_net [get_bd_pins SubmissionQueueManag_3/done] [get_bd_ports core_done_3] [get_bd_pins CmdScheduler_3/done]
connect_bd_net [get_bd_pins hw_dispatch_queue_3/prog_empty] [get_bd_pins CmdScheduler_3/dispatch_queue_prog_empty]
connect_bd_net [get_bd_pins SubmissionQueueManag_3/cmd_rd_en] [get_bd_pins hw_dispatch_queue_3/rd_en]
connect_bd_net [get_bd_pins SubmissionQueueManag_3/cpl_go] [get_bd_pins CompletionQueueManag_3/go]
connect_bd_net [get_bd_pins SubmissionQueueManag_3/cpl_cpls_to_wait] [get_bd_pins CompletionQueueManag_3/num_cmds_to_wait]
connect_bd_net [get_bd_pins CompletionQueueManag_3/done] [get_bd_pins SubmissionQueueManag_3/cpl_done]
connect_bd_net [get_bd_pins hw_dispatch_queue_3/dout] [get_bd_pins SubmissionQueueManag_3/cmd_dout]
connect_bd_net [get_bd_pins hw_dispatch_queue_3/empty] [get_bd_pins SubmissionQueueManag_3/cmd_empty]
connect_bd_net [get_bd_pins xlconstant_axprot/dout] [get_bd_pins axi_mem_intercon/S00_AXI_awprot] [get_bd_pins axi_mem_intercon/S00_AXI_arprot]
connect_bd_net [get_bd_pins xlconstant_axcache/dout] [get_bd_pins axi_mem_intercon/S00_AXI_awcache] [get_bd_pins axi_mem_intercon/S00_AXI_arcache]
set_property HDL_ATTRIBUTE.DEBUG true [get_bd_intf_nets periph_intercon_0_M00_AXI]
set_property HDL_ATTRIBUTE.MARK_DEBUG true [get_bd_intf_nets periph_intercon_0_M00_AXI]
set_property HDL_ATTRIBUTE.DEBUG true [get_bd_intf_nets xdma_0_M_AXI_B]
set_property HDL_ATTRIBUTE.MARK_DEBUG true [get_bd_intf_nets xdma_0_M_AXI_B]
set_property HDL_ATTRIBUTE.DEBUG true [get_bd_intf_nets zynq_ultra_ps_e_0_M_AXI_HPM0_FPD]
set_property HDL_ATTRIBUTE.MARK_DEBUG true [get_bd_intf_nets zynq_ultra_ps_e_0_M_AXI_HPM0_FPD]
set_property HDL_ATTRIBUTE.DEBUG true [get_bd_nets SubmissionQueueManag_0_done]
set_property HDL_ATTRIBUTE.MARK_DEBUG true [get_bd_nets SubmissionQueueManag_0_done]
set_property HDL_ATTRIBUTE.DEBUG true [get_bd_nets SubmissionQueueManag_1_done]
set_property HDL_ATTRIBUTE.MARK_DEBUG true [get_bd_nets SubmissionQueueManag_1_done]

# ---- address map ----
assign_bd_address -offset 0x0000000040000000 -range 1G -target_address_space [get_bd_addr_spaces CmdScheduler_0/M00_AXI] [get_bd_addr_segs zynq_ultra_ps_e_0/SAXIGP0/HPC0_DDR_LOW]
assign_bd_address -offset 0x00000000C0000000 -range 512M -target_address_space [get_bd_addr_spaces CmdScheduler_0/M00_AXI] [get_bd_addr_segs zynq_ultra_ps_e_0/SAXIGP0/HPC0_QSPI]
assign_bd_address -offset 0x00000000FF000000 -range 16M -target_address_space [get_bd_addr_spaces CmdScheduler_0/M00_AXI] [get_bd_addr_segs zynq_ultra_ps_e_0/SAXIGP0/HPC0_LPS_OCM]
assign_bd_address -offset 0x0000000800000000 -range 32G -target_address_space [get_bd_addr_spaces CmdScheduler_0/M00_AXI] [get_bd_addr_segs zynq_ultra_ps_e_0/SAXIGP0/HPC0_DDR_HIGH]
exclude_bd_addr_seg -offset 0x0000000080000000 -range 64K -target_address_space [get_bd_addr_spaces CmdScheduler_0/M00_AXI] [get_bd_addr_segs SubmissionQueueManag_0/S00_AXI_FULL/S00_AXI_FULL_mem]
exclude_bd_addr_seg -offset 0x0000000080010000 -range 64K -target_address_space [get_bd_addr_spaces CmdScheduler_0/M00_AXI] [get_bd_addr_segs CompletionQueueManag_0/S00_AXI_FULL/S00_AXI_FULL_mem]
exclude_bd_addr_seg -offset 0x0000000080020000 -range 64K -target_address_space [get_bd_addr_spaces CmdScheduler_0/M00_AXI] [get_bd_addr_segs SubmissionQueueManag_1/S00_AXI_FULL/S00_AXI_FULL_mem]
exclude_bd_addr_seg -offset 0x0000000080030000 -range 64K -target_address_space [get_bd_addr_spaces CmdScheduler_0/M00_AXI] [get_bd_addr_segs CompletionQueueManag_1/S00_AXI_FULL/S00_AXI_FULL_mem]
exclude_bd_addr_seg -offset 0x0000000080040000 -range 64K -target_address_space [get_bd_addr_spaces CmdScheduler_0/M00_AXI] [get_bd_addr_segs SubmissionQueueManag_2/S00_AXI_FULL/S00_AXI_FULL_mem]
exclude_bd_addr_seg -offset 0x0000000080050000 -range 64K -target_address_space [get_bd_addr_spaces CmdScheduler_0/M00_AXI] [get_bd_addr_segs CompletionQueueManag_2/S00_AXI_FULL/S00_AXI_FULL_mem]
exclude_bd_addr_seg -offset 0x0000000080060000 -range 64K -target_address_space [get_bd_addr_spaces CmdScheduler_0/M00_AXI] [get_bd_addr_segs SubmissionQueueManag_3/S00_AXI_FULL/S00_AXI_FULL_mem]
exclude_bd_addr_seg -offset 0x0000000080070000 -range 64K -target_address_space [get_bd_addr_spaces CmdScheduler_0/M00_AXI] [get_bd_addr_segs CompletionQueueManag_3/S00_AXI_FULL/S00_AXI_FULL_mem]
assign_bd_address -offset 0x0000000040000000 -range 1G -target_address_space [get_bd_addr_spaces CmdScheduler_1/M00_AXI] [get_bd_addr_segs zynq_ultra_ps_e_0/SAXIGP0/HPC0_DDR_LOW]
assign_bd_address -offset 0x00000000C0000000 -range 512M -target_address_space [get_bd_addr_spaces CmdScheduler_1/M00_AXI] [get_bd_addr_segs zynq_ultra_ps_e_0/SAXIGP0/HPC0_QSPI]
assign_bd_address -offset 0x00000000FF000000 -range 16M -target_address_space [get_bd_addr_spaces CmdScheduler_1/M00_AXI] [get_bd_addr_segs zynq_ultra_ps_e_0/SAXIGP0/HPC0_LPS_OCM]
assign_bd_address -offset 0x0000000800000000 -range 32G -target_address_space [get_bd_addr_spaces CmdScheduler_1/M00_AXI] [get_bd_addr_segs zynq_ultra_ps_e_0/SAXIGP0/HPC0_DDR_HIGH]
exclude_bd_addr_seg -offset 0x0000000080000000 -range 64K -target_address_space [get_bd_addr_spaces CmdScheduler_1/M00_AXI] [get_bd_addr_segs SubmissionQueueManag_0/S00_AXI_FULL/S00_AXI_FULL_mem]
exclude_bd_addr_seg -offset 0x0000000080010000 -range 64K -target_address_space [get_bd_addr_spaces CmdScheduler_1/M00_AXI] [get_bd_addr_segs CompletionQueueManag_0/S00_AXI_FULL/S00_AXI_FULL_mem]
exclude_bd_addr_seg -offset 0x0000000080020000 -range 64K -target_address_space [get_bd_addr_spaces CmdScheduler_1/M00_AXI] [get_bd_addr_segs SubmissionQueueManag_1/S00_AXI_FULL/S00_AXI_FULL_mem]
exclude_bd_addr_seg -offset 0x0000000080030000 -range 64K -target_address_space [get_bd_addr_spaces CmdScheduler_1/M00_AXI] [get_bd_addr_segs CompletionQueueManag_1/S00_AXI_FULL/S00_AXI_FULL_mem]
exclude_bd_addr_seg -offset 0x0000000080040000 -range 64K -target_address_space [get_bd_addr_spaces CmdScheduler_1/M00_AXI] [get_bd_addr_segs SubmissionQueueManag_2/S00_AXI_FULL/S00_AXI_FULL_mem]
exclude_bd_addr_seg -offset 0x0000000080050000 -range 64K -target_address_space [get_bd_addr_spaces CmdScheduler_1/M00_AXI] [get_bd_addr_segs CompletionQueueManag_2/S00_AXI_FULL/S00_AXI_FULL_mem]
exclude_bd_addr_seg -offset 0x0000000080060000 -range 64K -target_address_space [get_bd_addr_spaces CmdScheduler_1/M00_AXI] [get_bd_addr_segs SubmissionQueueManag_3/S00_AXI_FULL/S00_AXI_FULL_mem]
exclude_bd_addr_seg -offset 0x0000000080070000 -range 64K -target_address_space [get_bd_addr_spaces CmdScheduler_1/M00_AXI] [get_bd_addr_segs CompletionQueueManag_3/S00_AXI_FULL/S00_AXI_FULL_mem]
assign_bd_address -offset 0x0000000040000000 -range 1G -target_address_space [get_bd_addr_spaces CmdScheduler_2/M00_AXI] [get_bd_addr_segs zynq_ultra_ps_e_0/SAXIGP0/HPC0_DDR_LOW]
assign_bd_address -offset 0x00000000C0000000 -range 512M -target_address_space [get_bd_addr_spaces CmdScheduler_2/M00_AXI] [get_bd_addr_segs zynq_ultra_ps_e_0/SAXIGP0/HPC0_QSPI]
assign_bd_address -offset 0x00000000FF000000 -range 16M -target_address_space [get_bd_addr_spaces CmdScheduler_2/M00_AXI] [get_bd_addr_segs zynq_ultra_ps_e_0/SAXIGP0/HPC0_LPS_OCM]
assign_bd_address -offset 0x0000000800000000 -range 32G -target_address_space [get_bd_addr_spaces CmdScheduler_2/M00_AXI] [get_bd_addr_segs zynq_ultra_ps_e_0/SAXIGP0/HPC0_DDR_HIGH]
exclude_bd_addr_seg -offset 0x0000000080000000 -range 64K -target_address_space [get_bd_addr_spaces CmdScheduler_2/M00_AXI] [get_bd_addr_segs SubmissionQueueManag_0/S00_AXI_FULL/S00_AXI_FULL_mem]
exclude_bd_addr_seg -offset 0x0000000080010000 -range 64K -target_address_space [get_bd_addr_spaces CmdScheduler_2/M00_AXI] [get_bd_addr_segs CompletionQueueManag_0/S00_AXI_FULL/S00_AXI_FULL_mem]
exclude_bd_addr_seg -offset 0x0000000080020000 -range 64K -target_address_space [get_bd_addr_spaces CmdScheduler_2/M00_AXI] [get_bd_addr_segs SubmissionQueueManag_1/S00_AXI_FULL/S00_AXI_FULL_mem]
exclude_bd_addr_seg -offset 0x0000000080030000 -range 64K -target_address_space [get_bd_addr_spaces CmdScheduler_2/M00_AXI] [get_bd_addr_segs CompletionQueueManag_1/S00_AXI_FULL/S00_AXI_FULL_mem]
exclude_bd_addr_seg -offset 0x0000000080040000 -range 64K -target_address_space [get_bd_addr_spaces CmdScheduler_2/M00_AXI] [get_bd_addr_segs SubmissionQueueManag_2/S00_AXI_FULL/S00_AXI_FULL_mem]
exclude_bd_addr_seg -offset 0x0000000080050000 -range 64K -target_address_space [get_bd_addr_spaces CmdScheduler_2/M00_AXI] [get_bd_addr_segs CompletionQueueManag_2/S00_AXI_FULL/S00_AXI_FULL_mem]
exclude_bd_addr_seg -offset 0x0000000080060000 -range 64K -target_address_space [get_bd_addr_spaces CmdScheduler_2/M00_AXI] [get_bd_addr_segs SubmissionQueueManag_3/S00_AXI_FULL/S00_AXI_FULL_mem]
exclude_bd_addr_seg -offset 0x0000000080070000 -range 64K -target_address_space [get_bd_addr_spaces CmdScheduler_2/M00_AXI] [get_bd_addr_segs CompletionQueueManag_3/S00_AXI_FULL/S00_AXI_FULL_mem]
assign_bd_address -offset 0x0000000040000000 -range 1G -target_address_space [get_bd_addr_spaces CmdScheduler_3/M00_AXI] [get_bd_addr_segs zynq_ultra_ps_e_0/SAXIGP0/HPC0_DDR_LOW]
assign_bd_address -offset 0x00000000C0000000 -range 512M -target_address_space [get_bd_addr_spaces CmdScheduler_3/M00_AXI] [get_bd_addr_segs zynq_ultra_ps_e_0/SAXIGP0/HPC0_QSPI]
assign_bd_address -offset 0x00000000FF000000 -range 16M -target_address_space [get_bd_addr_spaces CmdScheduler_3/M00_AXI] [get_bd_addr_segs zynq_ultra_ps_e_0/SAXIGP0/HPC0_LPS_OCM]
assign_bd_address -offset 0x0000000800000000 -range 32G -target_address_space [get_bd_addr_spaces CmdScheduler_3/M00_AXI] [get_bd_addr_segs zynq_ultra_ps_e_0/SAXIGP0/HPC0_DDR_HIGH]
exclude_bd_addr_seg -offset 0x0000000080000000 -range 64K -target_address_space [get_bd_addr_spaces CmdScheduler_3/M00_AXI] [get_bd_addr_segs SubmissionQueueManag_0/S00_AXI_FULL/S00_AXI_FULL_mem]
exclude_bd_addr_seg -offset 0x0000000080010000 -range 64K -target_address_space [get_bd_addr_spaces CmdScheduler_3/M00_AXI] [get_bd_addr_segs CompletionQueueManag_0/S00_AXI_FULL/S00_AXI_FULL_mem]
exclude_bd_addr_seg -offset 0x0000000080020000 -range 64K -target_address_space [get_bd_addr_spaces CmdScheduler_3/M00_AXI] [get_bd_addr_segs SubmissionQueueManag_1/S00_AXI_FULL/S00_AXI_FULL_mem]
exclude_bd_addr_seg -offset 0x0000000080030000 -range 64K -target_address_space [get_bd_addr_spaces CmdScheduler_3/M00_AXI] [get_bd_addr_segs CompletionQueueManag_1/S00_AXI_FULL/S00_AXI_FULL_mem]
exclude_bd_addr_seg -offset 0x0000000080040000 -range 64K -target_address_space [get_bd_addr_spaces CmdScheduler_3/M00_AXI] [get_bd_addr_segs SubmissionQueueManag_2/S00_AXI_FULL/S00_AXI_FULL_mem]
exclude_bd_addr_seg -offset 0x0000000080050000 -range 64K -target_address_space [get_bd_addr_spaces CmdScheduler_3/M00_AXI] [get_bd_addr_segs CompletionQueueManag_2/S00_AXI_FULL/S00_AXI_FULL_mem]
exclude_bd_addr_seg -offset 0x0000000080060000 -range 64K -target_address_space [get_bd_addr_spaces CmdScheduler_3/M00_AXI] [get_bd_addr_segs SubmissionQueueManag_3/S00_AXI_FULL/S00_AXI_FULL_mem]
exclude_bd_addr_seg -offset 0x0000000080070000 -range 64K -target_address_space [get_bd_addr_spaces CmdScheduler_3/M00_AXI] [get_bd_addr_segs CompletionQueueManag_3/S00_AXI_FULL/S00_AXI_FULL_mem]
assign_bd_address -offset 0x00000000A0000000 -range 256M -target_address_space [get_bd_addr_spaces CompletionQueueManag_0/M00_AXI_LITE] [get_bd_addr_segs xdma_0/S_AXI_B/BAR0]
exclude_bd_addr_seg -offset 0x0000000400000000 -range 512M -target_address_space [get_bd_addr_spaces CompletionQueueManag_0/M00_AXI_LITE] [get_bd_addr_segs xdma_0/S_AXI_LITE/CTL0]
exclude_bd_addr_seg -offset 0x0000000420000000 -range 4K -target_address_space [get_bd_addr_spaces CompletionQueueManag_0/M00_AXI_LITE] [get_bd_addr_segs CmdScheduler_0/S00_AXI_LITE/S00_AXI_LITE_reg]
exclude_bd_addr_seg -offset 0x0000000420001000 -range 4K -target_address_space [get_bd_addr_spaces CompletionQueueManag_0/M00_AXI_LITE] [get_bd_addr_segs CmdScheduler_1/S00_AXI_LITE/S00_AXI_LITE_reg]
exclude_bd_addr_seg -offset 0x0000000420002000 -range 4K -target_address_space [get_bd_addr_spaces CompletionQueueManag_0/M00_AXI_LITE] [get_bd_addr_segs CmdScheduler_2/S00_AXI_LITE/S00_AXI_LITE_reg]
exclude_bd_addr_seg -offset 0x0000000420003000 -range 4K -target_address_space [get_bd_addr_spaces CompletionQueueManag_0/M00_AXI_LITE] [get_bd_addr_segs CmdScheduler_3/S00_AXI_LITE/S00_AXI_LITE_reg]
assign_bd_address -offset 0x00000000A0000000 -range 256M -target_address_space [get_bd_addr_spaces CompletionQueueManag_1/M00_AXI_LITE] [get_bd_addr_segs xdma_0/S_AXI_B/BAR0]
